# Altium project DIP SWITCH.PrjPcb
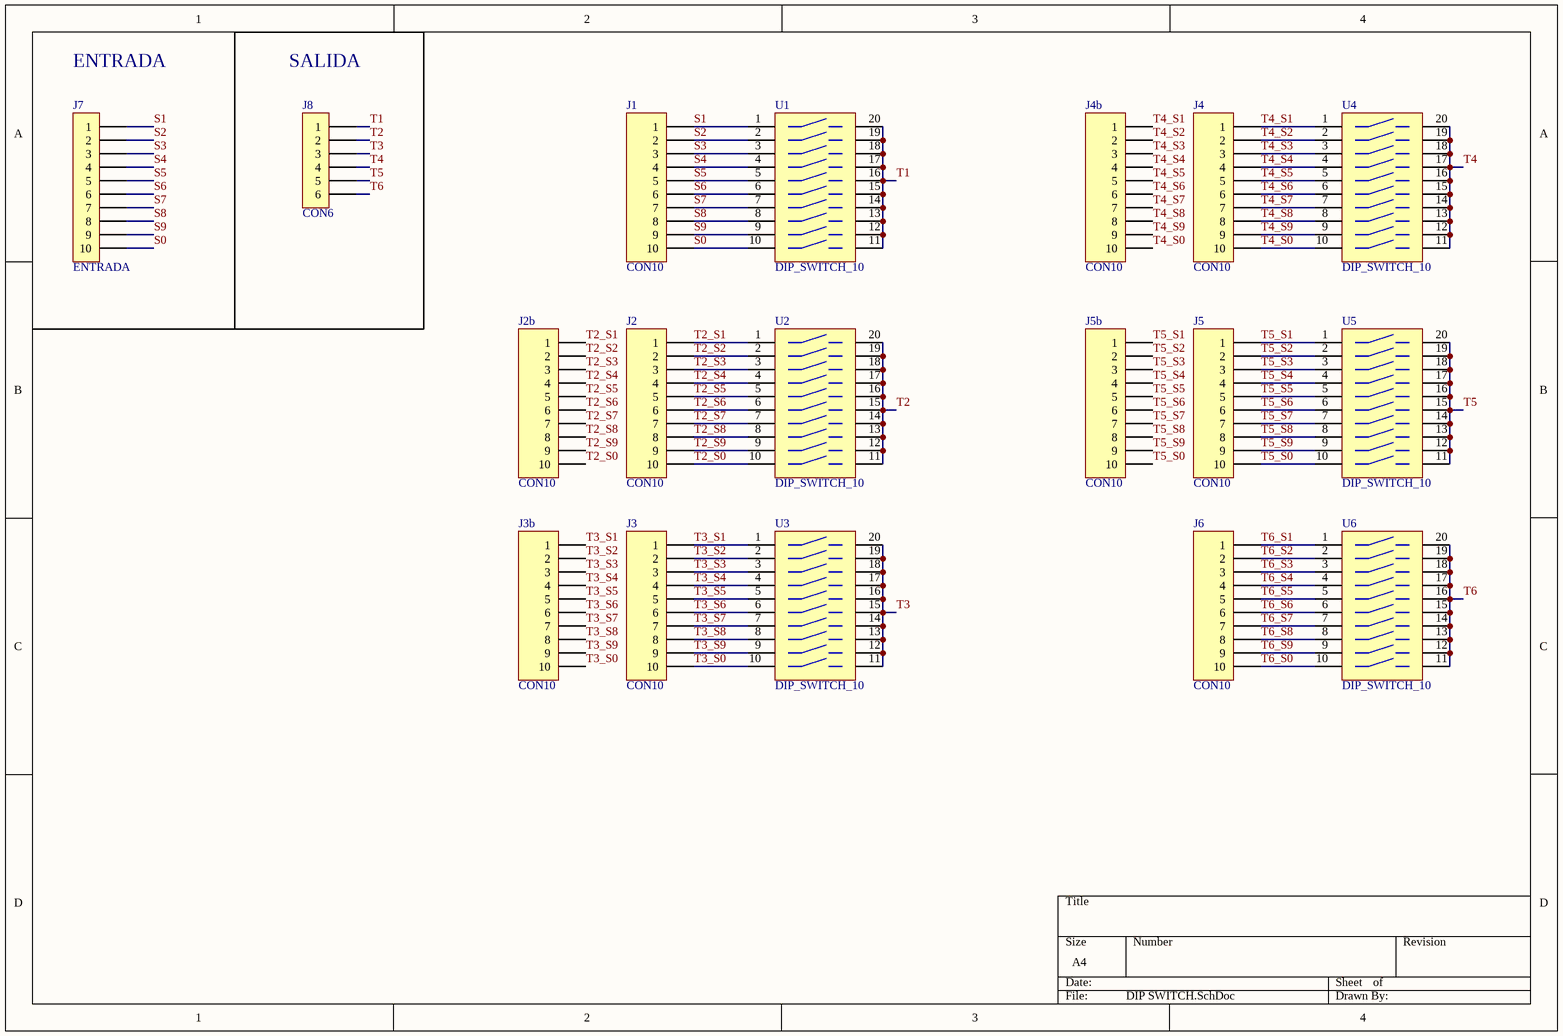
[diagram p0: DIP SWITCH.SchDoc]
1 sheet, 18 parts. Net scope: global (net labels, ports and power ports of the same name join across sheets).
Board files: DIP SWITCH.PcbDoc, PANEL.PcbDoc

## Sheet DIP SWITCH.SchDoc
size A4

### Parts
J1  CON10  [SIP10]
J2  CON10  [SIP10]
J2b  CON10  [SIP10]
J3  CON10  [SIP10]
J3b  CON10  [SIP10]
J4  CON10  [SIP10]
J4b  CON10  [SIP10]
J5  CON10  [SIP10]
J5b  CON10  [SIP10]
J6  CON10  [SIP10]
J7  ENTRADA  [BORNERA10]
J8  CON6  [SIP6]
U1  DIP_SWITCH_10  [DIP20]
U2  DIP_SWITCH_10  [DIP20]
U3  DIP_SWITCH_10  [DIP20]
U4  DIP_SWITCH_10  [DIP20]
U5  DIP_SWITCH_10  [DIP20]
U6  DIP_SWITCH_10  [DIP20]

### Nets
S0: J1.10 J7.10 U1.10
S1: J1.1 J7.1 U1.1
S2: J1.2 J7.2 U1.2
S3: J1.3 J7.3 U1.3
S4: J1.4 J7.4 U1.4
S5: J1.5 J7.5 U1.5
S6: J1.6 J7.6 U1.6
S7: J1.7 J7.7 U1.7
S8: J1.8 J7.8 U1.8
S9: J1.9 J7.9 U1.9
T1: J8.1 U1.11 U1.12 U1.13 U1.14 U1.15 U1.16 U1.17 U1.18 U1.19 U1.20
T2: J8.2 U2.11 U2.12 U2.13 U2.14 U2.15 U2.16 U2.17 U2.18 U2.19 U2.20
T2_S0: J2.10 J2b.10 U2.10
T2_S1: J2.1 J2b.1 U2.1
T2_S2: J2.2 J2b.2 U2.2
T2_S3: J2.3 J2b.3 U2.3
T2_S4: J2.4 J2b.4 U2.4
T2_S5: J2.5 J2b.5 U2.5
T2_S6: J2.6 J2b.6 U2.6
T2_S7: J2.7 J2b.7 U2.7
T2_S8: J2.8 J2b.8 U2.8
T2_S9: J2.9 J2b.9 U2.9
T3: J8.3 U3.11 U3.12 U3.13 U3.14 U3.15 U3.16 U3.17 U3.18 U3.19 U3.20
T3_S0: J3.10 J3b.10 U3.10
T3_S1: J3.1 J3b.1 U3.1
T3_S2: J3.2 J3b.2 U3.2
T3_S3: J3.3 J3b.3 U3.3
T3_S4: J3.4 J3b.4 U3.4
T3_S5: J3.5 J3b.5 U3.5
T3_S6: J3.6 J3b.6 U3.6
T3_S7: J3.7 J3b.7 U3.7
T3_S8: J3.8 J3b.8 U3.8
T3_S9: J3.9 J3b.9 U3.9
T4: J8.4 U4.11 U4.12 U4.13 U4.14 U4.15 U4.16 U4.17 U4.18 U4.19 U4.20
T4_S0: J4.10 J4b.10 U4.10
T4_S1: J4.1 J4b.1 U4.1
T4_S2: J4.2 J4b.2 U4.2
T4_S3: J4.3 J4b.3 U4.3
T4_S4: J4.4 J4b.4 U4.4
T4_S5: J4.5 J4b.5 U4.5
T4_S6: J4.6 J4b.6 U4.6
T4_S7: J4.7 J4b.7 U4.7
T4_S8: J4.8 J4b.8 U4.8
T4_S9: J4.9 J4b.9 U4.9
T5: J8.5 U5.11 U5.12 U5.13 U5.14 U5.15 U5.16 U5.17 U5.18 U5.19 U5.20
T5_S0: J5.10 J5b.10 U5.10
T5_S1: J5.1 J5b.1 U5.1
T5_S2: J5.2 J5b.2 U5.2
T5_S3: J5.3 J5b.3 U5.3
T5_S4: J5.4 J5b.4 U5.4
T5_S5: J5.5 J5b.5 U5.5
T5_S6: J5.6 J5b.6 U5.6
T5_S7: J5.7 J5b.7 U5.7
T5_S8: J5.8 J5b.8 U5.8
T5_S9: J5.9 J5b.9 U5.9
T6: J8.6 U6.11 U6.12 U6.13 U6.14 U6.15 U6.16 U6.17 U6.18 U6.19 U6.20
T6_S0: J6.10 U6.10
T6_S1: J6.1 U6.1
T6_S2: J6.2 U6.2
T6_S3: J6.3 U6.3
T6_S4: J6.4 U6.4
T6_S5: J6.5 U6.5
T6_S6: J6.6 U6.6
T6_S7: J6.7 U6.7
T6_S8: J6.8 U6.8
T6_S9: J6.9 U6.9

### Notes on the sheet
- ENTRADA
- SALIDA

### Library data of the parts
J7 = BORNERA10
U1-U6 = DIPSWITCH10: Dip_Switch 10 Posiciones